# EAGLE design Adafruit ATtiny8x7 Breakout (EAGLE 9.6.2)
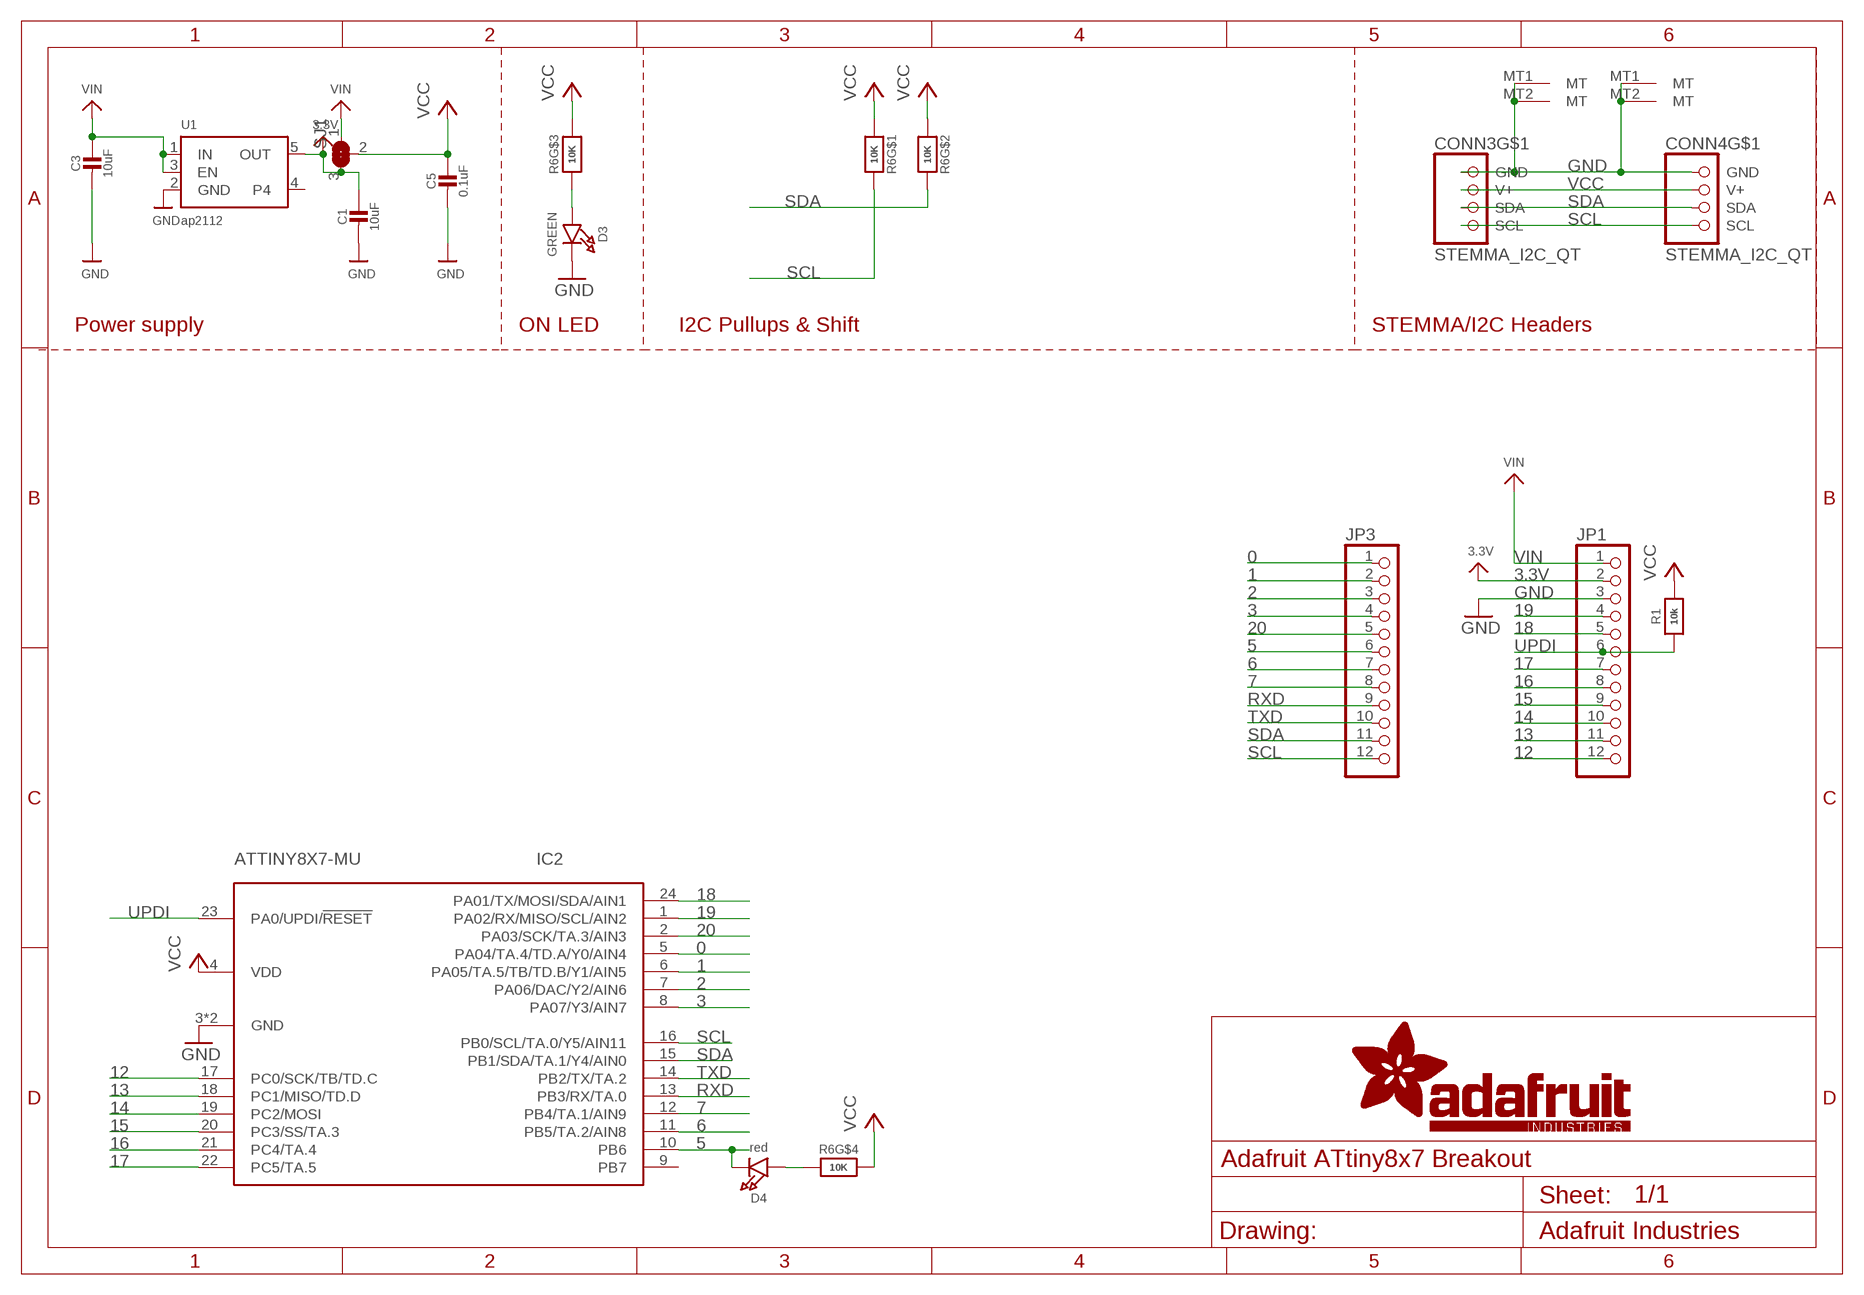
[diagram p0: schematic, sheet 1]

## Parts
C1  10uF  CAP_CERAMIC0805_10MGAP  [0805_10MGAP]
C3  10uF  CAP_CERAMIC0805-NOOUTLINE  [0805-NO]
C5  0.1uF  CAP_CERAMIC0603_NO  [0603-NO]
CONN3  STEMMA_I2C_QT  [JST_SH4]
CONN4  STEMMA_I2C_QT  [JST_SH4]
D3  GREEN  LED0603_NOOUTLINE  [CHIPLED_0603_NOOUTLINE]
D4  red  LED0603_NOOUTLINE  [CHIPLED_0603_NOOUTLINE]
IC2  ATTINY8X7-MU  [QFN24_4MM]
JP1  HEADER-1X1276MIL  [1X12_ROUND_76MIL]
JP3  HEADER-1X1276MIL  [1X12_ROUND_76MIL]
R1  10k  RESISTOR_0603_NOOUT  [0603-NO]
R6  10K  RESISTOR_4PACK  [RESPACK_4X0603]
SJ1  SOLDERJUMPER_2WAY  [SOLDERJUMPER_2WAY_OPEN_NOPASTE]
U1  ap2112  VREG_SOT23-5  [SOT23-5]

## Nets
0: IC2.5(PA04/TA.4/TD.A/Y0/AIN4) JP3.1
1: IC2.6(PA05/TA.5/TB/TD.B/Y1/AIN5) JP3.2
2: IC2.7(PA06/DAC/Y2/AIN6) JP3.3
3: IC2.8(PA07/Y3/AIN7) JP3.4
3.3V [highpower]: C1.1 JP1.2 SJ1.3 U1.5(OUT)
5: D4.C IC2.10(PB6) JP3.6
6: IC2.11(PB5/TA.2/AIN8) JP3.7
7: IC2.12(PB4/TA.1/AIN9) JP3.8
12: IC2.17(PC0/SCK/TB/TD.C) JP1.12
13: IC2.18(PC1/MISO/TD.D) JP1.11
14: IC2.19(PC2/MOSI) JP1.10
15: IC2.20(PC3/SS/TA.3) JP1.9
16: IC2.21(PC4/TA.4) JP1.8
17: IC2.22(PC5/TA.5) JP1.7
18: IC2.24(PA01/TX/MOSI/SDA/AIN1) JP1.5
19: IC2.1(PA02/RX/MISO/SCL/AIN2) JP1.4
20: IC2.2(PA03/SCK/TA.3/AIN3) JP3.5
GND [highpower]: C1.2 C3.2 C5.2 CONN3.1(GND) CONN3.MT1(MT) CONN3.MT2(MT) CONN4.1(GND) CONN4.MT1(MT) CONN4.MT2(MT) D3.C IC2.3(GND) IC2.THERM(GND) JP1.3 U1.2(GND)
N$1: D3.A R6.3
N$4: D4.A R6.4
RXD: IC2.13(PB3/RX/TA.0) JP3.9
SCL: CONN3.4(SCL) CONN4.4(SCL) IC2.16(PB0/SCL/TA.0/Y5/AIN11) JP3.12 R6.8
SDA: CONN3.3(SDA) CONN4.3(SDA) IC2.15(PB1/SDA/TA.1/Y4/AIN0) JP3.11 R6.7
TXD: IC2.14(PB2/TX/TA.2) JP3.10
UPDI: IC2.23(PA0/UPDI/!RESET) JP1.6 R1.1
VCC [highpower]: C5.1 CONN3.2(V+) CONN4.2(V+) IC2.4(VDD) R1.2 R6.1 R6.2 R6.5 R6.6 SJ1.2
VIN [highpower]: C3.1 JP1.1 SJ1.1 U1.1(IN) U1.3(EN)
Unconnected: IC2.9(PB7) U1.4

## Notes on the sheet
- Power supply | ON LED | I2C Pullups & Shift | STEMMA/I2C Headers

## Library data of the parts
C1 C3 C5 = microbuilder:CAP_CERAMIC: Ceramic Capacitors For new designs, use the packages preceded by an '_' character since they are more reliable: The following footprints should be used on most boards: _0402 - Standard footprint for regular board layouts _0603 - Standard footprint for regular board layouts _0805 - Standard footprint for regular board layouts _1206 - Standard footprint for regular board layouts For extremely tight-pitch boards where space is at a premium, the following 'micro-pitch' footprints can be used (smaller pads, no silkscreen outline, etc.): _0402MP - Micro-pitch footprint for very dense/compact boards _0603MP - Micro-pitch footprint for very dense/compact boards _0805MP - Micro-pitch footprint for very dense/compact boards _1206MP - Micro-pitch footprint for very dense/compact boards
CONN3 CONN4 = microbuilder:STEMMA_I2C
D3 D4 = microbuilder:LED: LED 0603 - 0603 Surface Mount Package 2mA: Green LED - Low Power (3.9mcd, 2ma, 1.7Vf) - Digikey: 475-2709-2-ND Orange LED - Low Power (9.8mcd, 2ma, 1.8Vf) - Digikey: 475-1194-2-ND Red LED - Low Power (5mcd, 2ma, 1.8Vf) - Digikey: 475-1195-2-ND Yellow LED - Low Power (7mcd, 2ma, 1.8Vf) - Digikey: 475-1196-2-ND 5mA: Blue LED - Low Power (17mcd, 5ma, 2.9Vf) - Digikey: LNJ937W8CRACT-ND 0805 - 0805 Surface Mount Package 2mA: Red LED (8.8mcd, 2mA, 1.8Vf, Clear) - Low Power [Digikey: 475-2510-1-ND] Green LED (5mcd, 2mA, 1.8Vf, Clear) - Low Power [Digikey: 475-2730-1-ND] Yellow LED (11.3mcd, 2mA, 1.8Vf, Clear) - Low Power [Digikey: 475-2555-1-ND] 20mA: Red LED (104mcd, 20mA, Diffused) - LS R976 [Digikey: 475-1278-6-ND] Red LED (12mcd, 20mA, 2.0Vf, Clear) - APT2012EC [Digikey: 754-1128-1-ND] Green LED (15mcd, 20mA, 2.2Vf, Clear) - APT2012GC [Digikey: 754-1131-1-ND] Orange LED (160mcd, 20mA, 2.1Vf, Clear) - APT2012SECK [Digikey: 754-1130-1-ND] 1206 - 1206 Surface Mount Package Green LED (26mcd, 20mA, Diffused) - LG N971 [Digikey: 475-1407-6-ND] Red LED (15mcd, 20mA, Diffused) - LH N974 [Digikey: 475-1416-6-ND] Cree - Cree High-Power Surface Mount LEDs XPEBWT-L1-0000-00D50 - White 111lm 350mA 2.9Vf 6200K 110° XTEAWT-00-0000-00000LEE3 - White 114lm 350mA 2.85Vf 5000K 115° Everlight - Everlight 45-21 Series Surface Mount LEDs 45-21/QK2C-B2832AC2CB2/2T - Warm White 2000mcd 20mA 3.25Vf 3050K 120° 45-21/LK2C-B38452C4CB2/2T - Nuetral White 2000mcd 20mA 3.25Vf 4150K 120° 45-21/LK2C-B50634C6CB2/2T - Cold White 2200mcd 20mA 3.25Vf 5650K 120° PLCC2 Reverse Mount LS T77K-J1L2-1-0-2-R18-Z - Red 11.25mcd 2mA 1.8Vf 630nm 120° LO T77K-L1M2-24-Z - Orange 19.6mcd 2mA 1.8Vf 606nm 120° LY T77K-K2M1-26-Z - Yellow 15.7mcd 2mA 1.8Vf 587nm 120°
IC2 = adafruit_micro:ATTINY8X7
JP1 JP3 = microbuilder:HEADER-1X12
R1 = microbuilder:RESISTOR: Resistors For new designs, use the packages preceded by an '_' character since they are more reliable: The following footprints should be used on most boards: _0402 - Standard footprint for regular board layouts _0603 - Standard footprint for regular board layouts _0805 - Standard footprint for regular board layouts _1206 - Standard footprint for regular board layouts For extremely tight-pitch boards where space is at a premium, the following 'micro-pitch' footprints can be used (smaller pads, no silkscreen outline, etc.): _0402MP - Micro-pitch footprint for very dense/compact boards _0603MP - Micro-pitch footprint for very dense/compact boards _0805MP - Micro-pitch footprint for very dense/compact boards _1206MP - Micro-pitch footprint for very dense/compact boards
R6 = microbuilder:RESISTOR_4PACK: Resistor Packs (4 resistors) 4 x 0603 10K 1/16W - Digikey: YC164J-10KCT-ND
SJ1 = microbuilder:SOLDERJUMPER_2WAY: 2-Way Solder Jumper
U1 = adafruit_power:VREG_SOT23-5: SOT23-5 Fixed Voltage Regulators Part Current Out V Out V In V Dropout θJA (°C/W) TJ (°C) Digikey Part No. ADP121 150mA 3.3V 3.4-5.5V 0.09V @ 150mA -- -- ADP121-AUJZ33R7CT-ND ADP121 150mA 3.0V 3.1-5.5V 0.09V @ 150mA -- -- ADP121-AUJZ30R7CT-ND ADP122 300mA 3.3V 3.4-5.5V 0.085V @ 300mA -- -- ADP122AUJZ-3.3-R7CT-ND ADP1712 300mA 3.3V 3.5-5.5V 0.17V @ 300mA -- -- ADP1712AUJZ-3.3-R7TR-ND AP7311 (Low Cost) 150mA 3.3V 3.5-6V 0.15V @ 150mA -- -- AP7311-33WG-7DICT-ND LD39015M18R 150mA 1.8V 1.9V-5.5V 0.08V @ 100mA -- -- 497-6977-1-ND LP2985A-33DBVR 150mA 3.3V 3.3-16V 0.28V @ 150mA 206 150 296-18479-1-ND MCP1824T-3302E/OT 300mA 3.3V 3.5V-6V 0.2V @ 300mA -- -- MCP1824T-3302E/OTCT-ND MIC5205-2.5YM5 TR 150mA 2.5V 2.7-16V 0.165V @ 150mA -- -- 576-1257-2-ND MIC5205-3.0YM5 TR 150mA 3.0V 3.2V-16V 0.165V @ 150mA -- -- 576-1258-2-ND MIC5205-3.3YM5 TR 150mA 3.3V 3.5V-16V 0.165V @ 150mA -- -- 576-1259-2-ND TPS780330220 150mA 3.3V+2.2V 3.6-5.5V 250mV Max -- -- 296-23332-1-ND TDA3663/N1,135 100mA 3.3V 3.5-45V 0.18V @ 50mA -- -- 568-5343-1-ND Max operating temp can be calculated using θJA, TJ (max junction temperature), and power in watts. Set the "Maximum Ambient Temperature" until it reaches TJ ("Max Junction Temperature"), which is the absolute limit for safe use of the regulator: Heat Sink Temperature Calculator <http://www.daycounter.com/Calculators/Heat-Sink-Temperature-Calculator.phtml> For example, With 12V source into a 3.3V LP2985 and a 30mA load, we are dissipating (12V-3.3V) * 0.03A = 0.261W. With a θJA of 206 °C/W, a TJ of 150°C, and 261mW we can safely use the chip without a heat sink up to 75°C (=147.1°C Junction Temperature).

## Net classes
1 highpower: width 0.254 mm, drill 0.483 mm

## Board
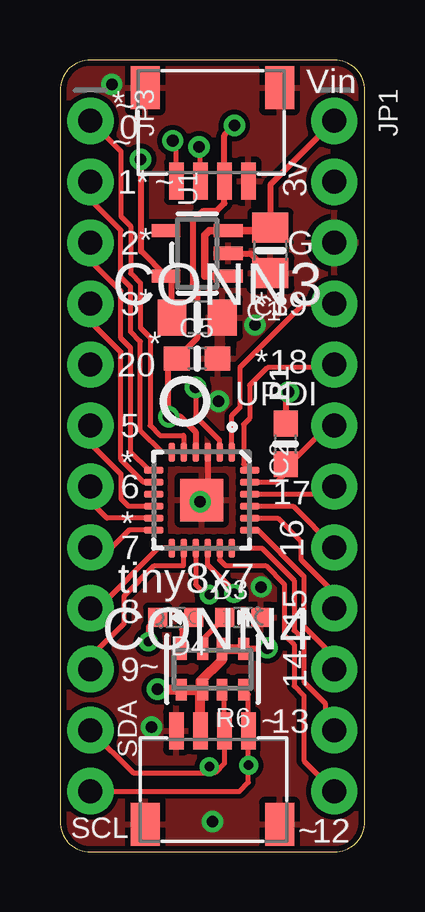
[diagram p1: board, top side]
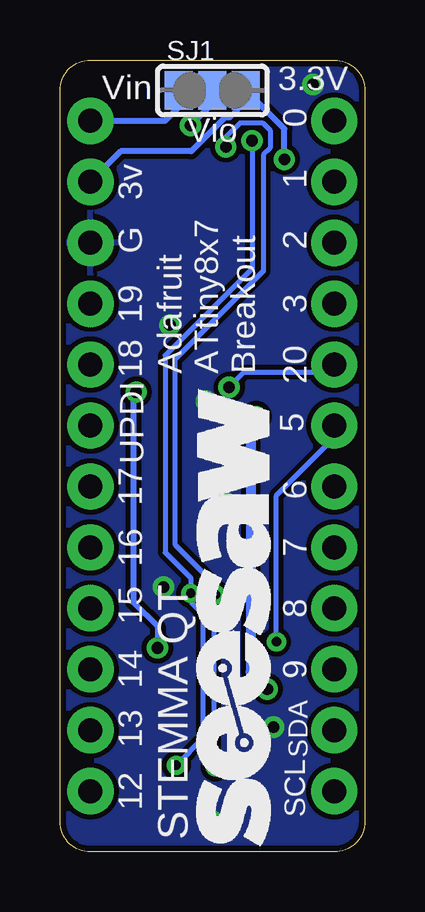
[diagram p2: board, bottom side, seen from below]

Size 12.7 x 33.02 mm. Coordinates in mm from the lower left corner, seen from the top.
Outline: 0,31.75 0,1.27 arc90 1.27,0 11.43,0 arc90 12.7,1.27 12.7,31.75 arc90 11.43,33.02 1.27,33.02 arc90 0,31.75
Copper layers (1*16): Top 0.035mm / dielectric 1.5mm / Bottom 0.035mm
Design rules "adafruit *": minimum track width 8mil, minimum drill 15.5mil, track to track 8mil, track to pad 8mil, pad to pad 8mil, via to via 8mil, smd to smd 8mil, copper to edge 10mil, drill to drill 8mil, minimum pad ring 10mil, minimum via ring 8mil, stop-mask expansion 2mil, vias tented up to drill 20mil, thermal gap 10mil

### Footprints (pad centres in the part's own frame; a part is rotated, then mirrored left to right if it is on the bottom)
0805_10MGAP = smd 1.2 x 1.5: 1 -1.05,0; 2 1.05,0
0805-NO = smd 1.24 x 1.5: 1 -0.95,0; 2 0.95,0
0603-NO = smd 1.075 x 1: 1 -0.85,0; 2 0.85,0
JST_SH4 = smd 0.6 x 1.55: 1 -1.5,2.514; 2 -0.5,2.514; 3 0.5,2.514; 4 1.5,2.514 | smd 1.2 x 1.8: MT1 -2.8,-1.386; MT2 2.8,-1.386
CHIPLED_0603_NOOUTLINE = smd 0.8 x 0.8: A 0,-0.75; C 0,0.75
QFN24_4MM = smd 0.8 x 0.28: 1 -2,1.25; 2 -2,0.75; 3 -2,0.25; 4 -2,-0.25; 5 -2,-0.75; 6 -2,-1.25; 13 2,-1.25; 14 2,-0.75; 15 2,-0.25; 16 2,0.25; 17 2,0.75; 18 2,1.25 | smd 0.28 x 0.8: 7 -1.25,-2; 8 -0.75,-2; 9 -0.25,-2; 10 0.25,-2; 11 0.75,-2; 12 1.25,-2; 19 1.25,2; 20 0.75,2; 21 0.25,2; 22 -0.25,2; 23 -0.75,2; 24 -1.25,2 | smd 1.778 x 1.778: THERM 0,0
1X12_ROUND_76MIL = drill 1 pad 1.93: 1 -13.97,0; 2 -11.43,0; 3 -8.89,0; 4 -6.35,0; 5 -3.81,0; 6 -1.27,0; 7 1.27,0; 8 3.81,0; 9 6.35,0; 10 8.89,0; 11 11.43,0; 12 13.97,0
RESPACK_4X0603 = smd 0.45 x 0.9: 1 -1.3,-0.85; 2 -0.4,-0.85; 3 0.4,-0.85; 4 1.3,-0.85; 5 1.3,0.85; 6 0.4,0.85; 7 -0.4,0.85; 8 -1.3,0.85
SOLDERJUMPER_2WAY_OPEN_NOPASTE = smd 1.168 x 1.6: 1 -1.397,0; 2 0,0; 3 1.397,0
SOT23-5 = smd 0.55 x 1.2: 1 -0.95,-1.3; 2 0,-1.3; 3 0.95,-1.3; 4 0.95,1.3; 5 -0.95,1.3

### Placement (x,y rotation side)
C1  5.71,22.29 0 top
C3  8.76,25.08 270 top
C5  5.71,20.57 0 top
CONN3  6.35,30.48 180 top
CONN4  6.35,2.54 0 top
D3  7.62,9.78 270 top
D4  4.83,9.78 90 top
IC2  5.91,14.67 270 top
JP1  11.43,16.51 270 top
JP3  1.27,16.51 270 top
R1  9.4,17.02 90 top
R6  6.35,7.62 180 top
SJ1  6.35,31.75 0 bottom
U1  5.71,24.96 90 top
U$7  [SEESAW_LOGO]  3.94,0.25 90 bottom
U$12  [PCBFEAT-REV-040]  5.21,18.8 0 top

### Tracks (layer width: path | path; a pad name or v marks a point on that pad's centre or on a via)
0
  Top 0.203: JP3.1 2.54,29.21 2.54,26.5 2.95,26.09 2.95,24.13 3.35,23.72 3.35,21.86 3.76,21.45 3.76,17.78 4.17,17.37 5.16,17.37 IC2.5
1
  Top 0.203: IC2.6 4.24,16.67 3.35,17.55 3.35,21.29 2.95,21.69 2.95,23.55 2.54,23.96 2.54,25.93 1.27,27.2 JP3.2
2
  Top 0.203: IC2.7 3.69,15.92 2.95,16.66 2.95,21.01 2.54,21.42 2.54,23.39 1.27,24.66 JP3.3
3
  Top 0.203: IC2.8 3.48,15.42 2.54,16.35 2.54,20.85 1.27,22.12 JP3.4
3.3V  (via drill 0.48)
  Top 0.254: v3.35,28.88 3.38,28.86 3.38,25.04 U1.5 4.67,23.75 C1.1
  Bottom 0.254: v3.35,28.88 3.35,30.15 SJ1.3 4.95,31.3 5.63,30.62 5.83,30.62 7.24,29.21 10.16,29.21 JP1.2
5  (via drill 0.39)
  Top 0.203: D4.C 3.68,9.39 v3.68,8.76 | JP3.6 1.27,17.04 2.54,15.77 2.54,14.73 2.85,14.42 IC2.10
  Bottom 0.203: v3.68,8.76 3.68,14.86 1.27,17.27 JP3.6
6
  Top 0.203: IC2.11 1.96,13.92 1.27,14.61 JP3.7
7
  Top 0.203: IC2.12 2.88,13.42 2.16,12.7 JP3.8
12
  Top 0.203: IC2.17 6.66,12.18 6.89,11.94 8.56,11.94 9.35,11.15 9.35,9.06 9.75,8.65 9.75,6.93 10.16,6.52 10.16,3.81 JP1.12
13
  Top 0.203: IC2.18 8.41,12.67 9.75,11.32 9.75,9.23 10.16,8.82 10.16,7.09 11.05,6.21 11.05,5.46 JP1.11
14
  Top 0.203: IC2.19 8.23,13.42 10.16,11.49 10.16,9.4 11.43,8.13 JP1.10
15
  Top 0.203: IC2.20 9.07,13.92 10.03,12.95 10.03,12.19 11.43,10.79 JP1.9
16
  Top 0.203: IC2.21 9.71,14.42 JP1.8
17
  Top 0.203: IC2.22 10.85,14.92 11.18,15.24 JP1.7
18
  Top 0.203: JP1.5 11.3,20.19 8.64,20.19 7.91,19.46 7.91,18.08 7.65,17.82 7.65,16.17 IC2.24
19
  Top 0.203: JP1.4 10.16,22.86 7.49,20.19 7.49,18.53 7.16,18.19 IC2.1
20  (via drill 0.48)
  Top 0.203: IC2.2 6.66,17.16 5.65,18.16 v5.65,19.37
  Bottom 0.203: v5.65,19.37 5.02,20 1.59,20 JP3.5
GND  (via drill 0.48)
  Top 0.254: U1.2 7.94,24.96 C3.2 | IC2.3 6.16,14.92 IC2.THERM
  other vias: 5.84,14.61 8.38,11.05 6.35,1.27 3.81,5.21 8.13,21.97 2.16,32 6.6,18.8
  pour Top: 0.13,32.96 12.7,33.02 12.7,0 0,0
  pour Bottom: 0.13,32.96 12.7,33.02 12.7,0 0,0
N$1
  Top 0.203: R6.3 5.95,8.86 D3.A
N$2
  Bottom 0.254: 6.73,31.75 7.37,31.75
N$4
  Top 0.203: D4.A 5.07,9.27 5.07,8.47 R6.4
RXD
  Top 0.203: JP3.9 1.58,10.16 4.09,12.67 IC2.13
SCL  (via drill 0.39, 0.48)
  Top 0.203: JP3.12 7.49,2.54 7.85,2.9 7.85,3.61 | 7.85,3.61 CONN4.4 7.85,6.57 R6.8 | 7.85,3.61 v7.86,3.62 | IC2.16 6.16,11.98 7.25,10.88 v7.25,10.79 | CONN3.4 4.85,29.5 v4.7,29.65
  Bottom 0.203: v7.86,3.62 6.73,4.75 6.73,9.91 7.25,10.43 v7.25,10.79 7.25,11.42 8.32,12.49 8.32,20.7 4.7,24.32 v4.7,29.65
SDA  (via drill 0.39, 0.48)
  Top 0.203: v6.22,10.73 6.07,10.73 5.66,11.14 IC2.15 | v6.22,3.56 6.22,3.3 | R6.7 6.85,6.67 CONN4.3 6.85,3.69 6.46,3.3 6.22,3.3 | JP3.11 3.05,3.3 6.22,3.3 | CONN3.3 5.85,29.34 v5.79,29.4
  Bottom 0.203: v6.22,3.56 6.29,3.62 6.29,10.67 v6.22,10.73 6.29,10.8 6.29,11.21 7.91,12.82 7.91,20.53 4.23,24.22 4.23,29.07 3.95,29.34 3.95,30.09 4.26,30.4 5.2,30.4 5.79,29.81 v5.79,29.4
TXD
  Top 0.203: IC2.14 5.16,11.94 3.94,11.94 2.67,10.67 2.67,9.53 1.27,8.13 JP3.10
UPDI
  Top 0.203: JP1.6 11.18,17.78 9.56,16.17 R1.1 9.4,15.79 9.02,15.41 9.02,15.42 IC2.23
VCC  (via drill 0.48)
  Top 0.254: IC2.4 5.66,17.51 5.02,18.15 v4.53,18.15 | v7.26,30.29 6.85,29.88 CONN3.2 6.85,27.04 6.54,26.73 5.97,26.73 5.52,26.29 5.52,23.62 5.71,23.43 5.71,21.42 C5.1 4.48,20.19 4.48,18.15 | R1.2 9.4,19.05 v9.53,19.18 | v8.64,8.51 8.6,8.47 R6.1
  Top 0.406: CONN4.2 5.85,6.67 | 5.85,6.67 R6.6 | 5.85,6.67 5.75,6.77 R6.5 4.09,6.77 v4.06,6.79 | R6.1 R6.2 6.75,8.02 5.85,7.12 5.85,6.67 | v4.53,18.15 4.48,18.15
  Bottom 0.254: v7.26,30.29 6.35,31.2 SJ1.2 | v9.53,19.18 9.65,19.05 9.65,10.41 8.64,9.4 v8.64,8.51
  Bottom 0.406: v4.06,6.79 4.76,7.49 4.76,18.15 v4.53,18.15
VIN
  Top 0.254: JP1.1 8.76,27.81 C3.1
  Top 0.305: C3.1 8.64,25.91 U1.3 6.22,25.91 6.03,25.72 6.03,24.01 U1.1
  Bottom 0.254: JP1.1 8.32,30.48 7.62,31.18 7.62,31.62 SJ1.1

### Text on the board
tPlace: Vin | * | ~ | 0 | ~ | 1 | 3v | * | ~ | 2 | * | G | 3 | 19 | * | * | * | 20 | * | 18 | UPDI | 5 | * | 6 | 17 | * | 7 | 16 | tiny8x7 | 8 | 15 | 9 | 14 | ~ | SDA | ~ | 13 | SCL | 12 | ~
bPlace: 3.3V | Vin | 0 | Vio | 1 | 3v | 2 | G | 3 | 19 | 18 | 20 | Adafruit / ATtiny8x7 / Breakout | 5 | UPDI | 6 | 17 | 7 | 16 | 8 | 15 | 9 | 14 | SDA | 13 | SCL | 12 | STEMMA QT